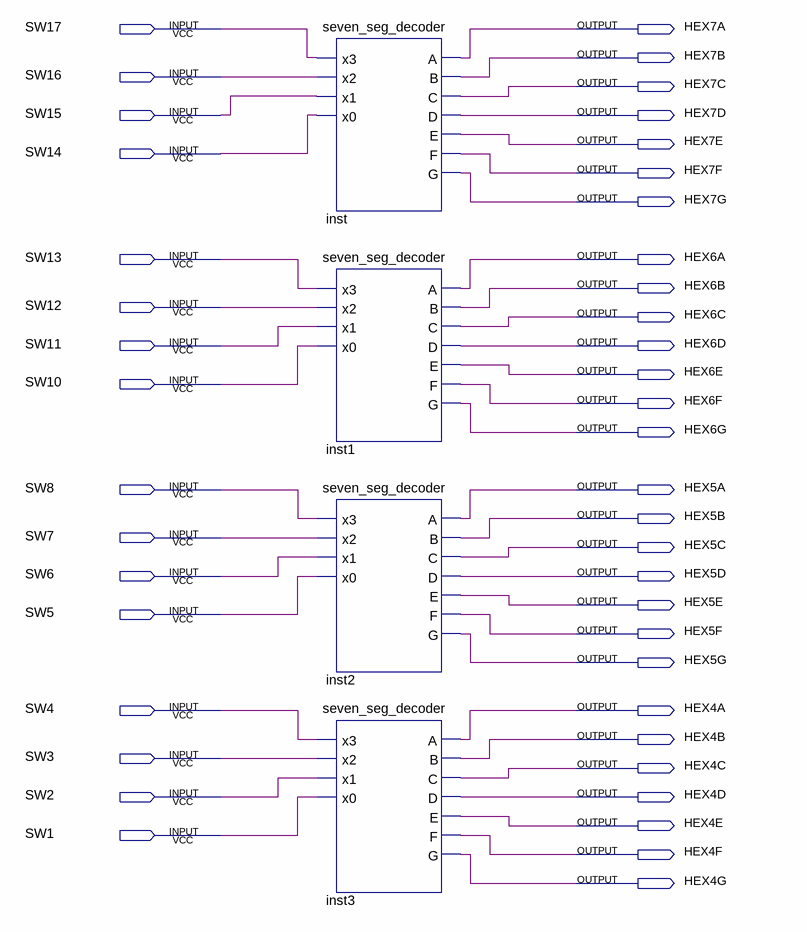
[diagram p0: schematic sheet]
// Quartus schematic lab5step1.bdf as structural Verilog: 4 symbols, 44 pins
module lab5step1 (
  input  SW17,
  input  SW16,
  input  SW15,
  input  SW14,
  input  SW13,
  input  SW12,
  input  SW11,
  input  SW10,
  input  SW8,
  input  SW7,
  input  SW6,
  input  SW5,
  input  SW4,
  input  SW3,
  input  SW2,
  input  SW1,
  output HEX7A,
  output HEX7B,
  output HEX7C,
  output HEX7D,
  output HEX7E,
  output HEX7F,
  output HEX7G,
  output HEX6A,
  output HEX6B,
  output HEX6C,
  output HEX6D,
  output HEX6E,
  output HEX6F,
  output HEX6G,
  output HEX5A,
  output HEX5B,
  output HEX5C,
  output HEX5D,
  output HEX5E,
  output HEX5F,
  output HEX5G,
  output HEX4A,
  output HEX4B,
  output HEX4C,
  output HEX4D,
  output HEX4E,
  output HEX4F,
  output HEX4G
);

  seven_seg_decoder inst (
    .x3(SW17), .x2(SW16), .x1(SW15), .x0(SW14), .A(HEX7A), .B(HEX7B), .C(HEX7C), .D(HEX7D), .E(HEX7E),
    .F(HEX7F), .G(HEX7G));
  seven_seg_decoder inst1 (
    .x3(SW13), .x2(SW12), .x1(SW11), .x0(SW10), .A(HEX6A), .B(HEX6B), .C(HEX6C), .D(HEX6D), .E(HEX6E),
    .F(HEX6F), .G(HEX6G));
  seven_seg_decoder inst2 (
    .x3(SW8), .x2(SW7), .x1(SW6), .x0(SW5), .A(HEX5A), .B(HEX5B), .C(HEX5C), .D(HEX5D), .E(HEX5E), .F(HEX5F),
    .G(HEX5G));
  seven_seg_decoder inst3 (
    .x3(SW4), .x2(SW3), .x1(SW2), .x0(SW1), .A(HEX4A), .B(HEX4B), .C(HEX4C), .D(HEX4D), .E(HEX4E), .F(HEX4F),
    .G(HEX4G));
endmodule
